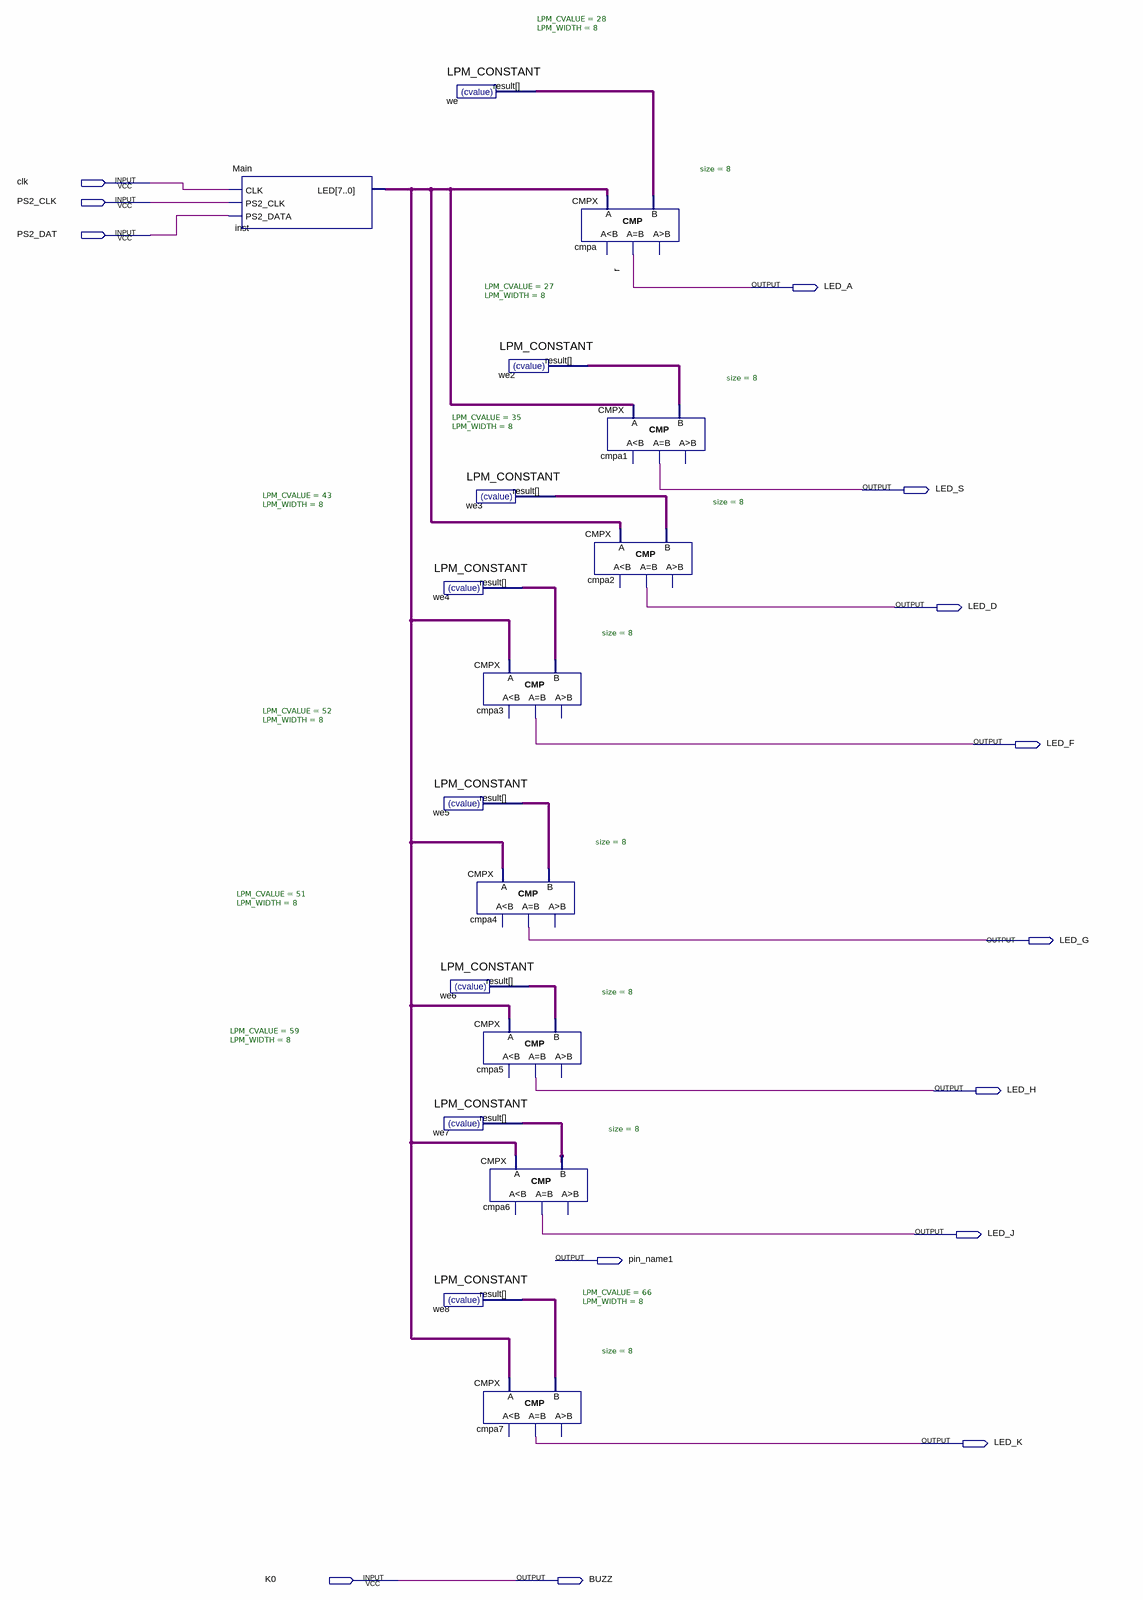
[diagram p0: schematic sheet]
// Quartus schematic ps2LEDR.bdf as structural Verilog: 17 symbols, 14 pins
module ps2LEDR (
  input  clk,
  input  PS2_CLK,
  input  PS2_DAT,
  input  K0,
  output LED_A,
  output LED_S,
  output LED_D,
  output LED_F,
  output LED_G,
  output LED_H,
  output LED_J,
  output pin_name1,
  output LED_K,
  output BUZZ
);

  wire [7:0] inst_led, we2_result, we3_result, we4_result, we5_result, we6_result, we7_result, we8_result,
       we_result;

  Main inst (.CLK(clk), .PS2_CLK(PS2_CLK), .PS2_DATA(PS2_DAT), .LED(inst_led));
  LPM_CONSTANT #(.LPM_CVALUE(43), .LPM_WIDTH(8)) we4 (.result(we4_result));
  LPM_CONSTANT #(.LPM_CVALUE(52), .LPM_WIDTH(8)) we5 (.result(we5_result));
  LPM_CONSTANT #(.LPM_CVALUE(59), .LPM_WIDTH(8)) we7 (.result(we7_result));
  LPM_CONSTANT #(.LPM_CVALUE(66), .LPM_WIDTH(8)) we8 (.result(we8_result));
  LPM_CONSTANT #(.LPM_CVALUE(28), .LPM_WIDTH(8)) we (.result(we_result));
  LPM_CONSTANT #(.LPM_CVALUE(35), .LPM_WIDTH(8)) we3 (.result(we3_result));
  CMPX #(.size(8)) cmpa3 (.A(inst_led), .B(we4_result), .eq(LED_F));  // open: ls, gr
  CMPX #(.size(8)) cmpa4 (.A(inst_led), .B(we5_result), .eq(LED_G));  // open: ls, gr
  LPM_CONSTANT #(.LPM_CVALUE(51), .LPM_WIDTH(8)) we6 (.result(we6_result));
  CMPX #(.size(8)) cmpa5 (.A(inst_led), .B(we6_result), .eq(LED_H));  // open: ls, gr
  CMPX #(.size(8)) cmpa6 (.A(inst_led), .B(we7_result), .eq(LED_J));  // open: ls, gr
  CMPX #(.size(8)) cmpa7 (.A(inst_led), .B(we8_result), .eq(LED_K));  // open: ls, gr
  LPM_CONSTANT #(.LPM_CVALUE(27), .LPM_WIDTH(8)) we2 (.result(we2_result));
  CMPX #(.size(8)) cmpa (.A(inst_led), .B(we_result), .eq(LED_A));  // open: ls, gr
  CMPX #(.size(8)) cmpa2 (.A(inst_led), .B(we3_result), .eq(LED_D));  // open: ls, gr
  CMPX #(.size(8)) cmpa1 (.A(inst_led), .B(we2_result), .eq(LED_S));  // open: ls, gr

  assign BUZZ = K0;

  // Other names for the same wires on the sheet: r = LED_A
endmodule
